# Altium schematic sheet TLM_002_MAX31856.SchDoc: =DocumentName
size A4; CompanyName: Scopa Industries LLC; Engineer: Nazar Lysenko / Andrii Antonenko; Organization: Scopa Industries LLC; Address1: Kyiv; Address2: Ukraine; Address3: https://www.scopa.industries/; Address4: oleksyi.y@scopa.industries; SheetNumber: 4; SheetTotal: 11
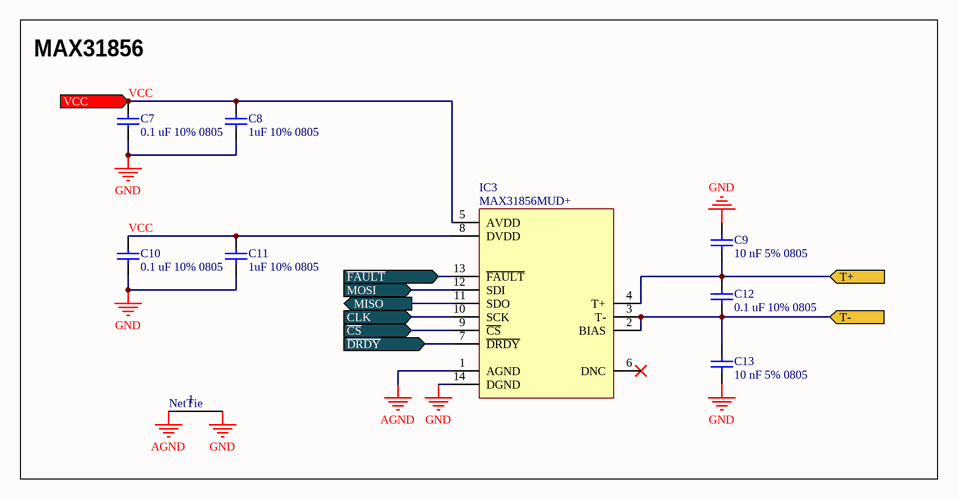
[diagram p0: TLM_002_MAX31856.SchDoc]

## Parts
1  NetTie  [NetTie]  (net tie, no BOM)
C7  0.1 uF 10% 0805  [CAPC2013X140X50ML20T25]
C8  1uF 10% 0805  [CAPC2013X145X50NL20T20]
C9  10 nF 5% 0805  [CAPC2013X94X50LL20T25]
C10  0.1 uF 10% 0805  [CAPC2013X140X50ML20T25]
C11  1uF 10% 0805  [CAPC2013X145X50NL20T20]
C12  0.1 uF 10% 0805  [CAPC2013X140X50ML20T25]
C13  10 nF 5% 0805  [CAPC2013X94X50LL20T25]
IC3  MAX31856MUD+  [SOP65P640X110-14N]

## Ports
CLK (in, see TLM_002_MBR[3B], TLM_002_CONNECT[1B], TLM_002_ESP32S3[2B], TLM_002_MAX6675[2B], TLM_002_SD[3B]), MISO (out, see TLM_002_MBR[3B], TLM_002_CONNECT[1A], TLM_002_ESP32S3[3B], TLM_002_MAX6675[2B], TLM_002_SD[3B]), MOSI (in, see TLM_002_MBR[3B], TLM_002_CONNECT[1A], TLM_002_ESP32S3[2B], TLM_002_SD[3B]), T+ (in, see TLM_002_MBR[3B]), T- (in, see TLM_002_MBR[3B]), VCC (in, see TLM_002_MBR[3B], TLM_002_DS3231SN_RTC[2B], TLM_002_ESP32S3[1A], TLM_002_INA228[1B], TLM_002_LoRa[2B], TLM_002_MAX6675[2B], TLM_002_MCP3021[3B], TLM_002_SD[1B]), ~{CS} (in, see TLM_002_MBR[3B]), ~{DRDY} (in, see TLM_002_MBR[3B]), ~{FAULT} (in, see TLM_002_MBR[3B])

## Nets
AGND: 1.1 IC3.1(AGND)
GND: 1.2 C7.1 C8.1 C9.2 C10.1 C11.1 C13.1 IC3.14(DGND)
~{CS}: IC3.9(~{CS}) ; port ~{CS}
CLK: IC3.10(SCK) ; port CLK
~{DRDY}: IC3.7(~{DRDY}) ; port ~{DRDY}
~{FAULT}: IC3.13(~{FAULT}) ; port ~{FAULT}
MISO: IC3.11(SDO) ; port MISO
MOSI: IC3.12(SDI) ; port MOSI
T+: C9.1 C12.2 IC3.4(T+) ; port T+
T-: C12.1 C13.2 IC3.2(BIAS) IC3.3(T-) ; port T-
VCC: C7.2 C8.2 C10.2 C11.2 IC3.5(AVDD) IC3.8(DVDD) ; port VCC

Not connected (* = marked no-connect by the designer): IC3 6(DNC)*

## Notes on the sheet
- MAX31856
- Title
- Size:
- Date:
- A4
- Author:
- Time:
- Sheet
- Revision:
- of
- File:

## Library data of the parts
C7 C10 C12 = CMP-2007-04651-1: Part Number: 0805DD104KAT2A; Manufacturer: AVX Interconnect / Elco
C8 C11 = CMP-2007-01676-1: Part Number: VJ0805Y105KXQRW1BC; Manufacturer: Vitramon
C9 C13 = CMP-2007-04234-1: Manufacturer: AVX Interconnect / Elco; Part Number: 08053C103JAT2A
IC3 = MAX31856MUD+: Integrated Circuit; Manufacturer_Name: Analog Devices; Datasheet Link: https://componentsearchengine.com/Datasheets/2/MAX31856MUD+.pdf; Height: 1.1mm; Manufacturer_Part_Number: MAX31856MUD+; Mouser Part Number: 700-MAX31856MUD+; Mouser Price/Stock: https://www.mouser.co.uk/ProductDetail/Analog-Devices-Maxim-Integrated/MAX31856MUD%2b?qs=sO%2FZ8XQFeM1TlxwAJsKRYw%3D%3D; Arrow Part Number: MAX31856MUD+; Arrow Price/Stock: https://www.arrow.com/en/products/max31856mud/analog-devices?utm_currency=USD&region=nac